# Altium project ControlBoard.PrjPcb
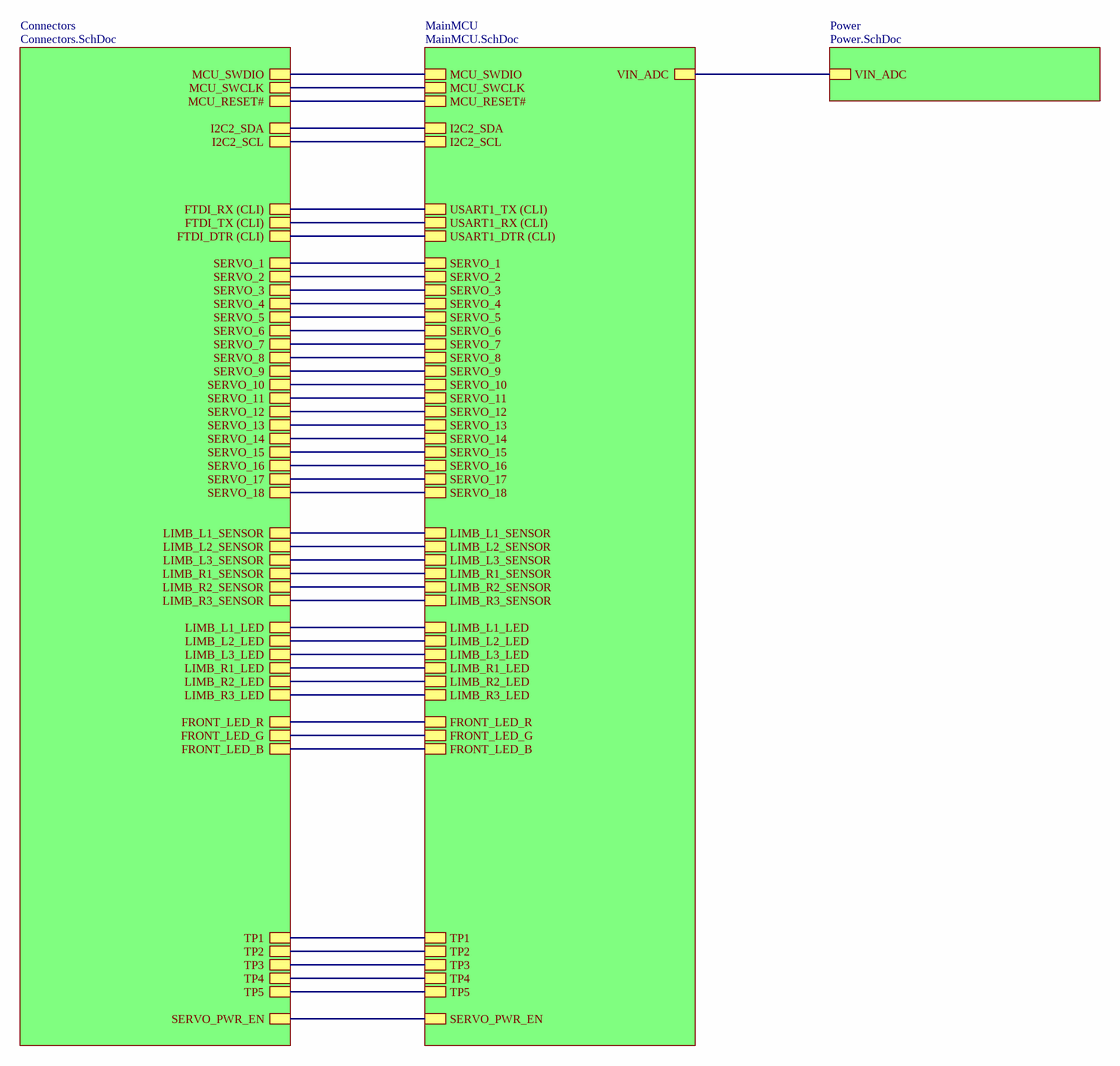
[diagram p0: Main.SchDoc]
4 sheets, 141 parts. Net scope: hierarchical (ports join the sheet entries above them; power ports are global).
Board file: PCB.PcbDoc
Sheets:
  Main.SchDoc
    Connectors = Connectors.SchDoc
    MainMCU = MainMCU.SchDoc
    Power = Power.SchDoc

## Sheet Main.SchDoc
size A3; SheetNumber: 1; SheetTotal: 1

### Sub-sheets
Connectors = Connectors.SchDoc: MCU_SWDIO, MCU_SWCLK, MCU_RESET#, FTDI_RX (CLI), FTDI_TX (CLI), SERVO_1, SERVO_2, SERVO_3, SERVO_4, SERVO_5, SERVO_6, SERVO_7, SERVO_8, SERVO_9, SERVO_10, SERVO_11, SERVO_12, SERVO_13, SERVO_14, SERVO_15, SERVO_16, SERVO_17, SERVO_18, SERVO_PWR_EN, I2C2_SDA, I2C2_SCL, FTDI_DTR (CLI), LIMB_L1_SENSOR, LIMB_L2_SENSOR, LIMB_L3_SENSOR, LIMB_R1_SENSOR, LIMB_R2_SENSOR, LIMB_R3_SENSOR, LIMB_L1_LED, LIMB_L2_LED, LIMB_L3_LED, LIMB_R1_LED, LIMB_R2_LED, LIMB_R3_LED, FRONT_LED_B, FRONT_LED_G, FRONT_LED_R, TP5, TP4, TP3, TP2, TP1
MainMCU = MainMCU.SchDoc: MCU_SWDIO, MCU_SWCLK, MCU_RESET#, USART1_TX (CLI), USART1_RX (CLI), VIN_ADC, SERVO_PWR_EN, I2C2_SDA, I2C2_SCL, USART1_DTR (CLI), SERVO_1, SERVO_2, SERVO_3, SERVO_4, SERVO_5, SERVO_6, SERVO_7, SERVO_8, SERVO_9, SERVO_10, SERVO_11, SERVO_12, SERVO_13, SERVO_14, SERVO_15, SERVO_16, SERVO_17, SERVO_18, LIMB_L1_SENSOR, LIMB_L2_SENSOR, LIMB_L3_SENSOR, LIMB_R1_SENSOR, LIMB_R2_SENSOR, LIMB_R3_SENSOR, FRONT_LED_R, FRONT_LED_G, FRONT_LED_B, TP5, TP4, TP3, TP2, TP1, LIMB_L1_LED, LIMB_L2_LED, LIMB_L3_LED, LIMB_R1_LED, LIMB_R2_LED, LIMB_R3_LED
Power = Power.SchDoc: VIN_ADC

### Nets
FRONT_LED_B: sheet Connectors/FRONT_LED_B, sheet MainMCU/FRONT_LED_B
FRONT_LED_G: sheet Connectors/FRONT_LED_G, sheet MainMCU/FRONT_LED_G
FRONT_LED_R: sheet Connectors/FRONT_LED_R, sheet MainMCU/FRONT_LED_R
FTDI_DTR (CLI): sheet Connectors/FTDI_DTR (CLI), sheet MainMCU/USART1_DTR (CLI)
FTDI_RX (CLI): sheet Connectors/FTDI_RX (CLI), sheet MainMCU/USART1_TX (CLI)
FTDI_TX (CLI): sheet Connectors/FTDI_TX (CLI), sheet MainMCU/USART1_RX (CLI)
I2C2_SCL: sheet Connectors/I2C2_SCL, sheet MainMCU/I2C2_SCL
I2C2_SDA: sheet Connectors/I2C2_SDA, sheet MainMCU/I2C2_SDA
LIMB_L1_LED: sheet Connectors/LIMB_L1_LED, sheet MainMCU/LIMB_L1_LED
LIMB_L1_SENSOR: sheet Connectors/LIMB_L1_SENSOR, sheet MainMCU/LIMB_L1_SENSOR
LIMB_L2_LED: sheet Connectors/LIMB_L2_LED, sheet MainMCU/LIMB_L2_LED
LIMB_L2_SENSOR: sheet Connectors/LIMB_L2_SENSOR, sheet MainMCU/LIMB_L2_SENSOR
LIMB_L3_LED: sheet Connectors/LIMB_L3_LED, sheet MainMCU/LIMB_L3_LED
LIMB_L3_SENSOR: sheet Connectors/LIMB_L3_SENSOR, sheet MainMCU/LIMB_L3_SENSOR
LIMB_R1_LED: sheet Connectors/LIMB_R1_LED, sheet MainMCU/LIMB_R1_LED
LIMB_R1_SENSOR: sheet Connectors/LIMB_R1_SENSOR, sheet MainMCU/LIMB_R1_SENSOR
LIMB_R2_LED: sheet Connectors/LIMB_R2_LED, sheet MainMCU/LIMB_R2_LED
LIMB_R2_SENSOR: sheet Connectors/LIMB_R2_SENSOR, sheet MainMCU/LIMB_R2_SENSOR
LIMB_R3_LED: sheet Connectors/LIMB_R3_LED, sheet MainMCU/LIMB_R3_LED
LIMB_R3_SENSOR: sheet Connectors/LIMB_R3_SENSOR, sheet MainMCU/LIMB_R3_SENSOR
MCU_RESET#: sheet Connectors/MCU_RESET#, sheet MainMCU/MCU_RESET#
MCU_SWCLK: sheet Connectors/MCU_SWCLK, sheet MainMCU/MCU_SWCLK
MCU_SWDIO: sheet Connectors/MCU_SWDIO, sheet MainMCU/MCU_SWDIO
SERVO_1: sheet Connectors/SERVO_1, sheet MainMCU/SERVO_1
SERVO_2: sheet Connectors/SERVO_2, sheet MainMCU/SERVO_2
SERVO_3: sheet Connectors/SERVO_3, sheet MainMCU/SERVO_3
SERVO_4: sheet Connectors/SERVO_4, sheet MainMCU/SERVO_4
SERVO_5: sheet Connectors/SERVO_5, sheet MainMCU/SERVO_5
SERVO_6: sheet Connectors/SERVO_6, sheet MainMCU/SERVO_6
SERVO_7: sheet Connectors/SERVO_7, sheet MainMCU/SERVO_7
SERVO_8: sheet Connectors/SERVO_8, sheet MainMCU/SERVO_8
SERVO_9: sheet Connectors/SERVO_9, sheet MainMCU/SERVO_9
SERVO_10: sheet Connectors/SERVO_10, sheet MainMCU/SERVO_10
SERVO_11: sheet Connectors/SERVO_11, sheet MainMCU/SERVO_11
SERVO_12: sheet Connectors/SERVO_12, sheet MainMCU/SERVO_12
SERVO_13: sheet Connectors/SERVO_13, sheet MainMCU/SERVO_13
SERVO_14: sheet Connectors/SERVO_14, sheet MainMCU/SERVO_14
SERVO_15: sheet Connectors/SERVO_15, sheet MainMCU/SERVO_15
SERVO_16: sheet Connectors/SERVO_16, sheet MainMCU/SERVO_16
SERVO_17: sheet Connectors/SERVO_17, sheet MainMCU/SERVO_17
SERVO_18: sheet Connectors/SERVO_18, sheet MainMCU/SERVO_18
SERVO_PWR_EN: sheet Connectors/SERVO_PWR_EN, sheet MainMCU/SERVO_PWR_EN
TP1: sheet Connectors/TP1, sheet MainMCU/TP1
TP2: sheet Connectors/TP2, sheet MainMCU/TP2
TP3: sheet Connectors/TP3, sheet MainMCU/TP3
TP4: sheet Connectors/TP4, sheet MainMCU/TP4
TP5: sheet Connectors/TP5, sheet MainMCU/TP5
VIN_ADC: sheet MainMCU/VIN_ADC, sheet Power/VIN_ADC

## Sheet Connectors.SchDoc
size A4; SheetNumber: 1; SheetTotal: 1
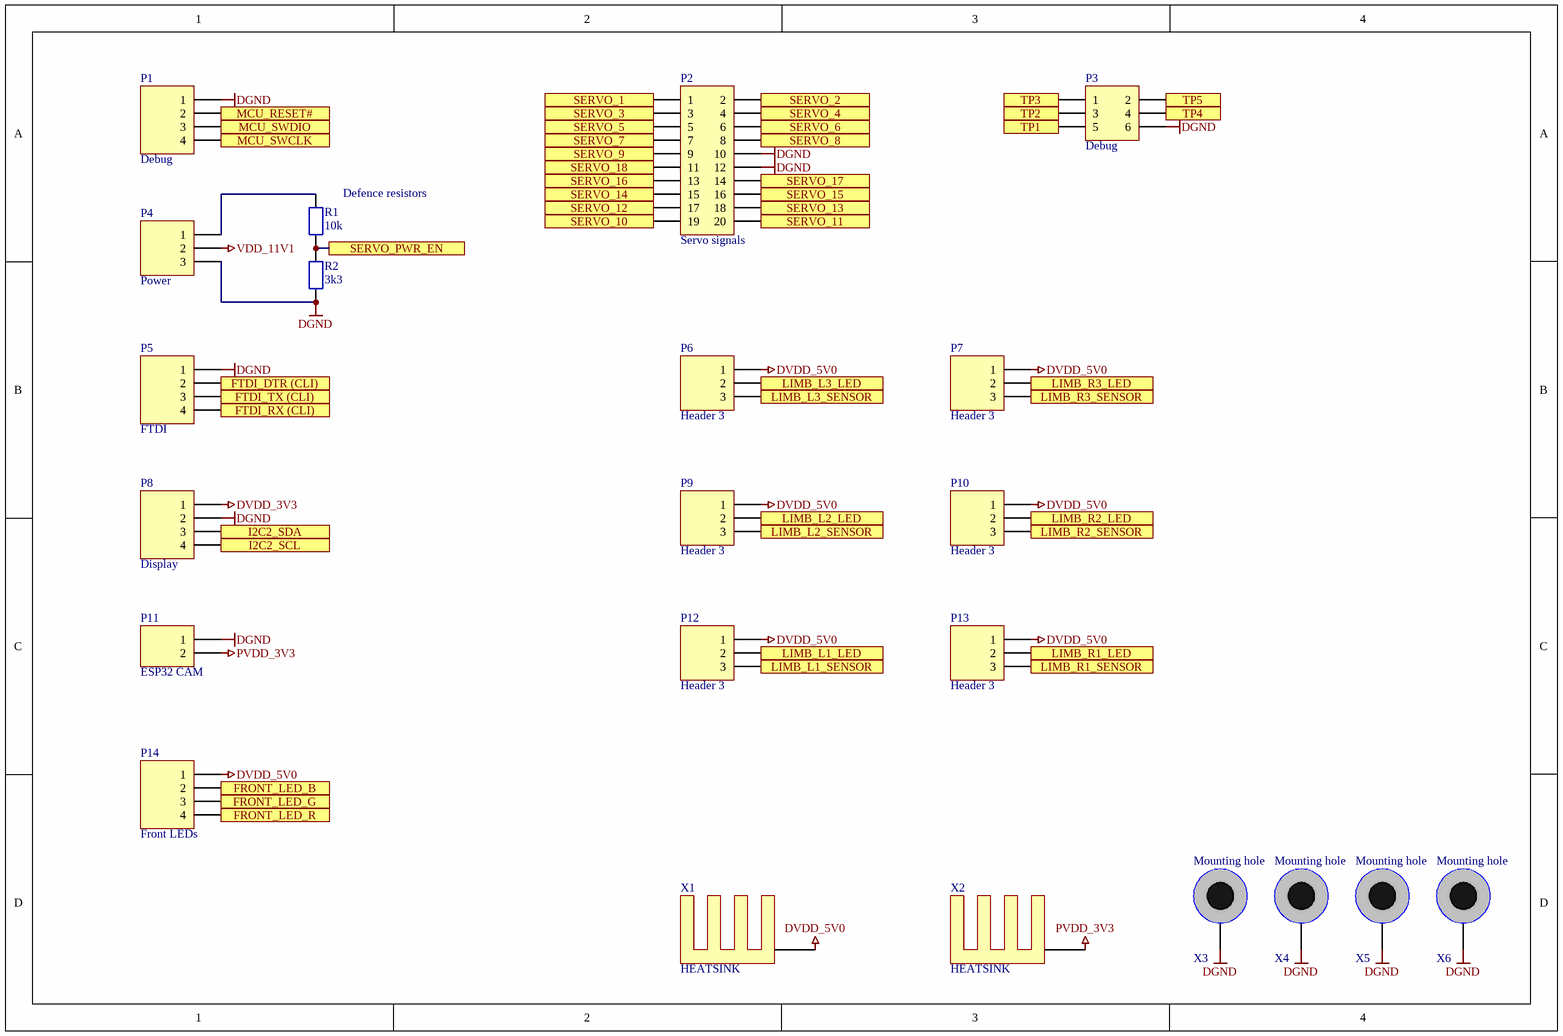
[diagram p1: Connectors.SchDoc]

### Parts
P1  Debug  [PLS-4 2.54]
P2  Servo signals  [IDC-20 OUTLINE]
P3  Debug  [PLD-3 2.54]
P4  Power  [PLS-3 2.54 OUTLINE]
P5  FTDI  [PLS-4R 2.54]
P6  Header 3  [PLS-3R 2.54]
P7  Header 3  [PLS-3R 2.54]
P8  Display  [PLS-4R 2.54]
P9  Header 3  [PLS-3R 2.54]
P10  Header 3  [PLS-3R 2.54]
P11  ESP32 CAM  [PLS-2 2.54 OUTLINE]
P12  Header 3  [PLS-3R 2.54]
P13  Header 3  [PLS-3R 2.54]
P14  Front LEDs  [PLS-4R 2.54]
R1  10k  [R_0603/1608]
R2  3k3  [R_0603/1608]
X1  HEATSINK  [HEATSINK 20x14x6]
X2  HEATSINK  [HEATSINK 20x14x6]
X3  Mounting hole  [HOLE_M2_D4.0/2.5]  (no BOM)
X4  Mounting hole  [HOLE_M2_D4.0/2.5]  (no BOM)
X5  Mounting hole  [HOLE_M2_D4.0/2.5]  (no BOM)
X6  Mounting hole  [HOLE_M2_D4.0/2.5]  (no BOM)

### Ports
FRONT_LED_B, FRONT_LED_G, FRONT_LED_R, FTDI_DTR (CLI), FTDI_RX (CLI), FTDI_TX (CLI), I2C2_SCL, I2C2_SDA, LIMB_L1_LED, LIMB_L1_SENSOR, LIMB_L2_LED, LIMB_L2_SENSOR, LIMB_L3_LED, LIMB_L3_SENSOR, LIMB_R1_LED, LIMB_R1_SENSOR, LIMB_R2_LED, LIMB_R2_SENSOR, LIMB_R3_LED, LIMB_R3_SENSOR, MCU_RESET#, MCU_SWCLK, MCU_SWDIO, SERVO_1, SERVO_2, SERVO_3, SERVO_4, SERVO_5, SERVO_6, SERVO_7, SERVO_8, SERVO_9, SERVO_10, SERVO_11, SERVO_12, SERVO_13, SERVO_14, SERVO_15, SERVO_16, SERVO_17, SERVO_18, SERVO_PWR_EN, TP1, TP2, TP3, TP4, TP5

### Nets
DGND: P1.1 P2.10 P2.12 P3.6 P4.3 P5.1 P8.2 P11.1 R2.1 X3.1 X4.1 X5.1 X6.1
DVDD_3V3: P8.1
DVDD_5V0: P6.1 P7.1 P9.1 P10.1 P12.1 P13.1 P14.1 X1.1
PVDD_3V3: P11.2 X2.1
VDD_11V1: P4.2
FRONT_LED_B: P14.2 ; port FRONT_LED_B
FRONT_LED_G: P14.3 ; port FRONT_LED_G
FRONT_LED_R: P14.4 ; port FRONT_LED_R
FTDI_DTR (CLI): P5.2 ; port FTDI_DTR (CLI)
FTDI_RX (CLI): P5.4 ; port FTDI_RX (CLI)
FTDI_TX (CLI): P5.3 ; port FTDI_TX (CLI)
I2C2_SCL: P8.4 ; port I2C2_SCL
I2C2_SDA: P8.3 ; port I2C2_SDA
LIMB_L1_LED: P12.2 ; port LIMB_L1_LED
LIMB_L1_SENSOR: P12.3 ; port LIMB_L1_SENSOR
LIMB_L2_LED: P9.2 ; port LIMB_L2_LED
LIMB_L2_SENSOR: P9.3 ; port LIMB_L2_SENSOR
LIMB_L3_LED: P6.2 ; port LIMB_L3_LED
LIMB_L3_SENSOR: P6.3 ; port LIMB_L3_SENSOR
LIMB_R1_LED: P13.2 ; port LIMB_R1_LED
LIMB_R1_SENSOR: P13.3 ; port LIMB_R1_SENSOR
LIMB_R2_LED: P10.2 ; port LIMB_R2_LED
LIMB_R2_SENSOR: P10.3 ; port LIMB_R2_SENSOR
LIMB_R3_LED: P7.2 ; port LIMB_R3_LED
LIMB_R3_SENSOR: P7.3 ; port LIMB_R3_SENSOR
MCU_RESET#: P1.2 ; port MCU_RESET#
MCU_SWCLK: P1.4 ; port MCU_SWCLK
MCU_SWDIO: P1.3 ; port MCU_SWDIO
SERVO_1: P2.1 ; port SERVO_1
SERVO_2: P2.2 ; port SERVO_2
SERVO_3: P2.3 ; port SERVO_3
SERVO_4: P2.4 ; port SERVO_4
SERVO_5: P2.5 ; port SERVO_5
SERVO_6: P2.6 ; port SERVO_6
SERVO_7: P2.7 ; port SERVO_7
SERVO_8: P2.8 ; port SERVO_8
SERVO_9: P2.9 ; port SERVO_9
SERVO_10: P2.19 ; port SERVO_10
SERVO_11: P2.20 ; port SERVO_11
SERVO_12: P2.17 ; port SERVO_12
SERVO_13: P2.18 ; port SERVO_13
SERVO_14: P2.15 ; port SERVO_14
SERVO_15: P2.16 ; port SERVO_15
SERVO_16: P2.13 ; port SERVO_16
SERVO_17: P2.14 ; port SERVO_17
SERVO_18: P2.11 ; port SERVO_18
SERVO_PWR_EN: R1.1 R2.2 ; port SERVO_PWR_EN
TP1: P3.5 ; port TP1
TP2: P3.3 ; port TP2
TP3: P3.1 ; port TP3
TP4: P3.4 ; port TP4
TP5: P3.2 ; port TP5
NetP4_1: P4.1 R1.2

### Notes on the sheet
- (near R1) Defence resistors

### Library data of the parts
P1 P5 P8 P14 = Header 4: Header, 4-Pin; LatestRevisionDate: 17-Jul-2002; LatestRevisionNote: Re-released for DXP Platform.; Publisher: Altium Limited
P2 = Header 2x10: Header, 20-Pin; LatestRevisionDate: 17-Jul-2002; LatestRevisionNote: Re-released for DXP Platform.; Publisher: Altium Limited
P3 = Header 2x3: Header, 2x3-Pin; LatestRevisionDate: 17-Jul-2002; LatestRevisionNote: Re-released for DXP Platform.; Publisher: Altium Limited
P4 P6 P7 P9 P10 P12 P13 = Header 3: Header, 3-Pin; LatestRevisionDate: 17-Jul-2002; LatestRevisionNote: Re-released for DXP Platform.; Publisher: Altium Limited
P11 = Header 2: Header, 2-Pin; LatestRevisionDate: 17-Jul-2002; LatestRevisionNote: Re-released for DXP Platform.; Publisher: Altium Limited
R1 R2 = Resistor
X3-X6 = Mounting hole: Hole for screw M3, outline D6

## Sheet MainMCU.SchDoc
size A3; SheetNumber: 1; SheetTotal: 1
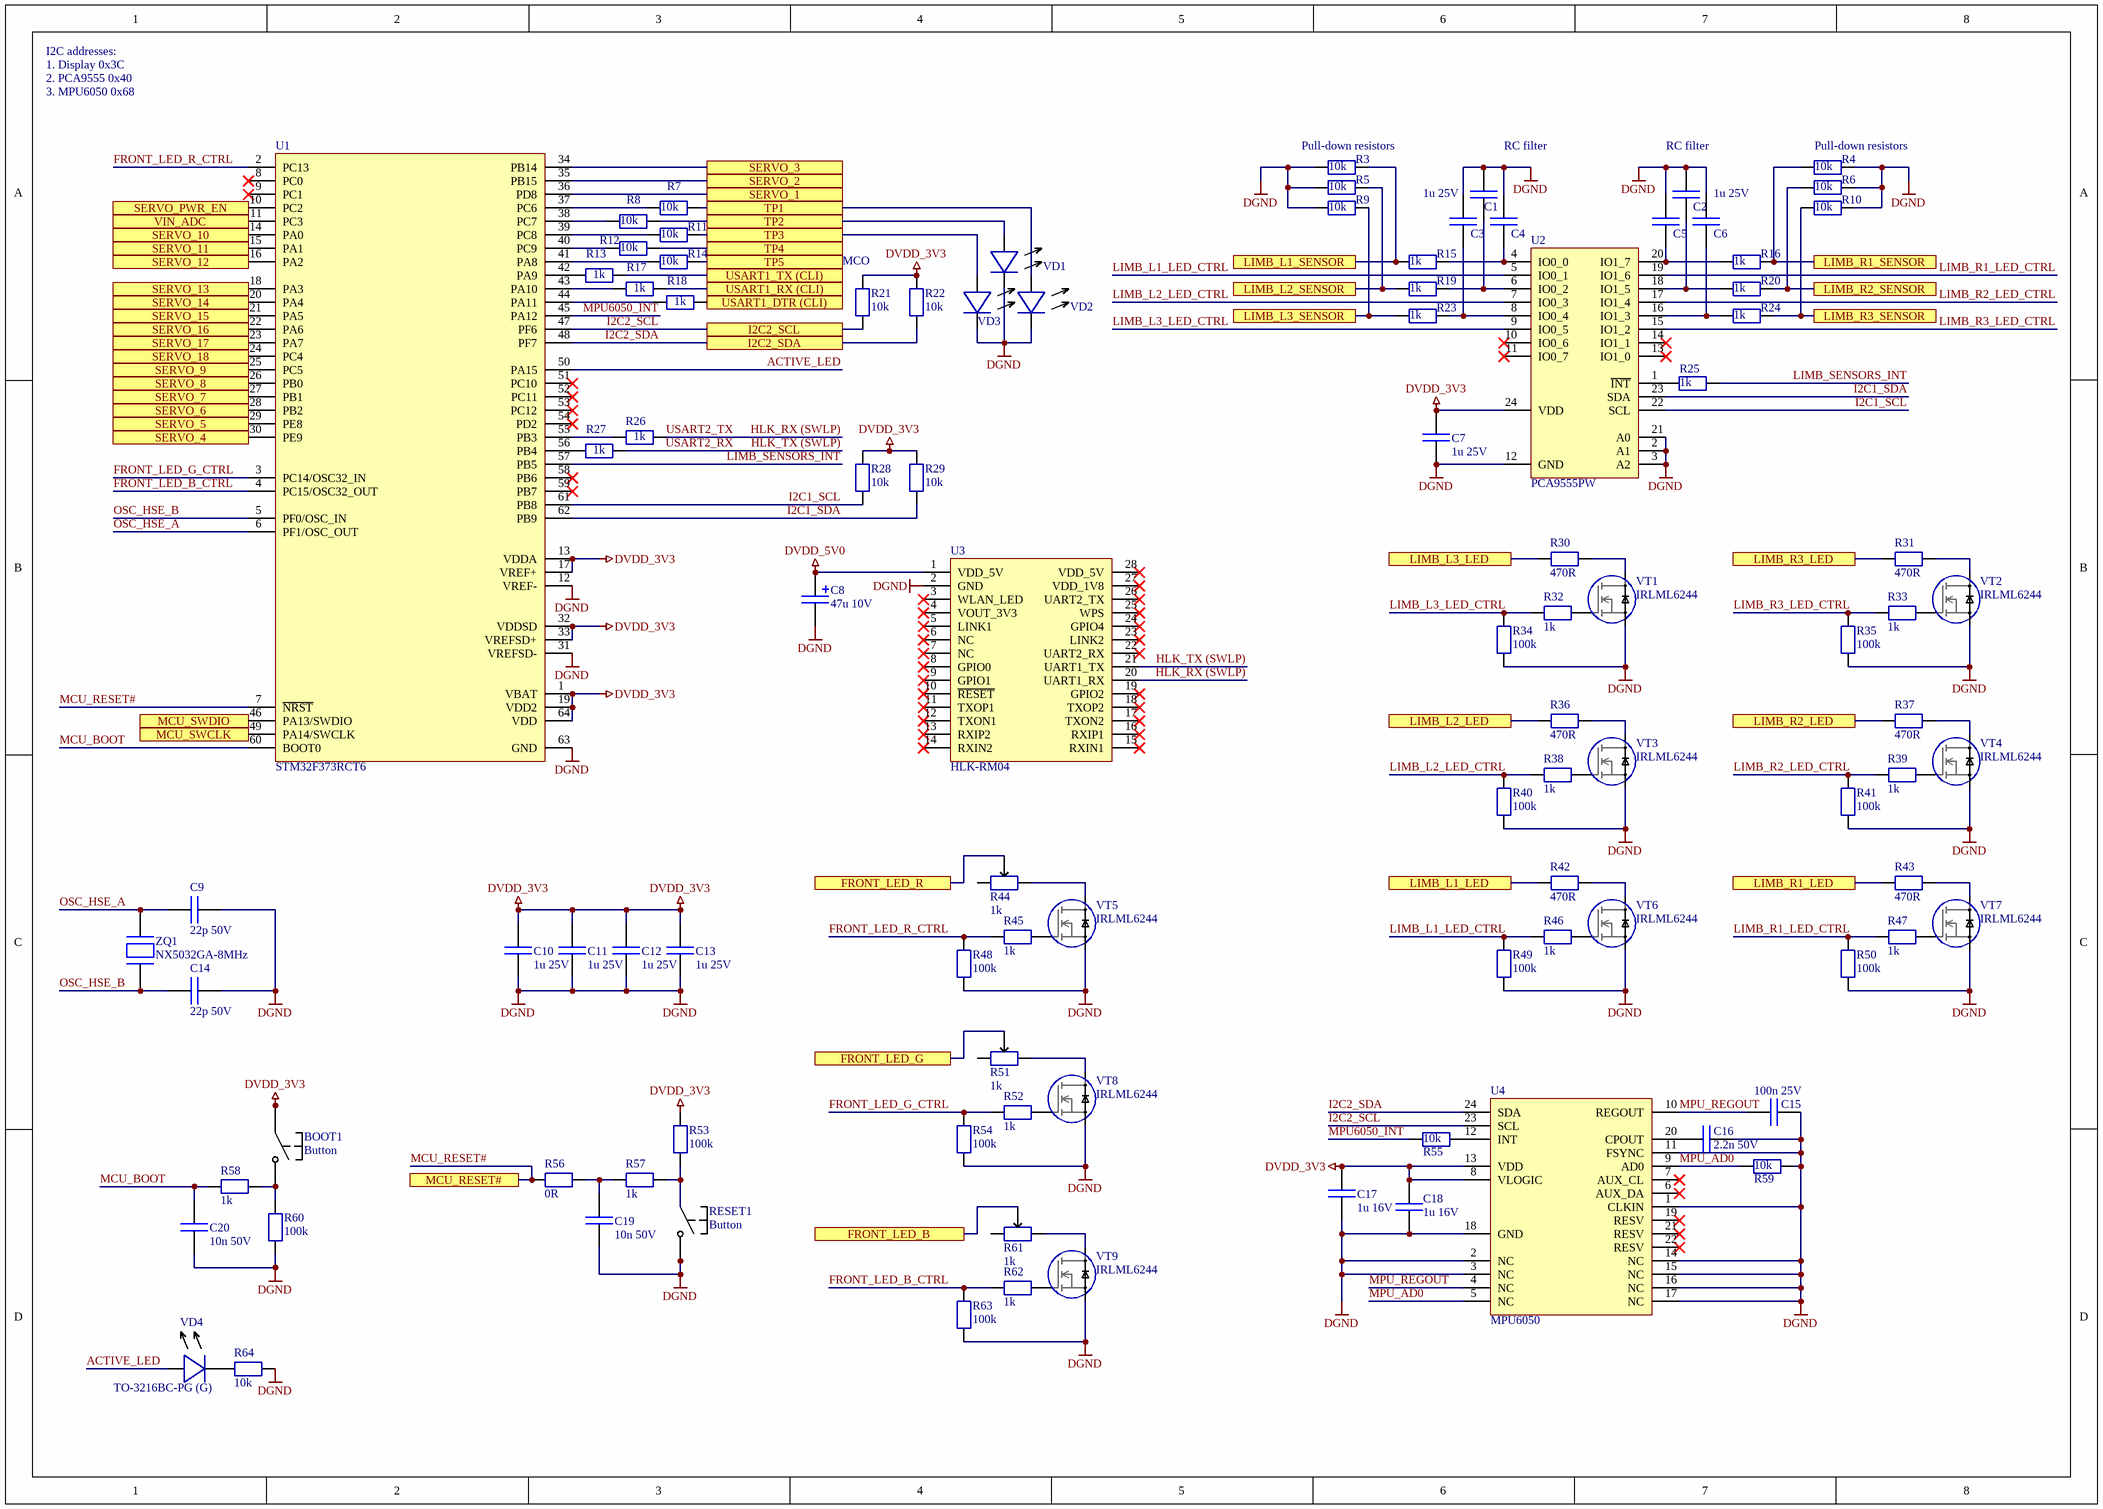
[diagram p2: MainMCU.SchDoc]

### Parts
BOOT1  Button  [BUTTON_SMD_3x6]
C1  1u 25V  [C_0603/1608]
C2  1u 25V  [C_0603/1608]
C3  1u 25V  [C_0603/1608]  (value not drawn)
C4  1u 25V  [C_0603/1608]  (value not drawn)
C5  1u 25V  [C_0603/1608]  (value not drawn)
C6  1u 25V  [C_0603/1608]  (value not drawn)
C7  1u 25V  [C_0603/1608]
C8  47u 10V  [TECAP_TYPE_B]
C9  22p 50V  [C_0603/1608]
C10  1u 25V  [C_0603/1608]
C11  1u 25V  [C_0603/1608]
C12  1u 25V  [C_0603/1608]
C13  1u 25V  [C_0603/1608]
C14  22p 50V  [C_0603/1608]
C15  100n 25V  [C_0603/1608]
C16  2.2n 50V  [C_0603/1608]
C17  1u 16V  [C_0402/1005]
C18  1u 16V  [C_0402/1005]
C19  10n 50V  [C_0603/1608]
C20  10n 50V  [C_0603/1608]
R3  10k  [R_0603/1608]
R4  10k  [R_0603/1608]
R5  10k  [R_0603/1608]
R6  10k  [R_0603/1608]
R7  10k  [R_0603/1608]
R8  10k  [R_0603/1608]
R9  10k  [R_0603/1608]
R10  10k  [R_0603/1608]
R11  10k  [R_0603/1608]
R12  10k  [R_0603/1608]
R13  1k  [R_0603/1608]
R14  10k  [R_0603/1608]
R15  1k  [R_0603/1608]
R16  1k  [R_0603/1608]
R17  1k  [R_0603/1608]
R18  1k  [R_0603/1608]
R19  1k  [R_0603/1608]
R20  1k  [R_0603/1608]
R21  10k  [R_0603/1608]
R22  10k  [R_0603/1608]
R23  1k  [R_0603/1608]
R24  1k  [R_0603/1608]
R25  1k  [R_0603/1608]
R26  1k  [R_0603/1608]
R27  1k  [R_0603/1608]
R28  10k  [R_0603/1608]
R29  10k  [R_0603/1608]
R30  470R  [R_0603/1608]
R31  470R  [R_0603/1608]
R32  1k  [R_0603/1608]
R33  1k  [R_0603/1608]
R34  100k  [R_0603/1608]
R35  100k  [R_0603/1608]
R36  470R  [R_0603/1608]
R37  470R  [R_0603/1608]
R38  1k  [R_0603/1608]
R39  1k  [R_0603/1608]
R40  100k  [R_0603/1608]
R41  100k  [R_0603/1608]
R42  470R  [R_0603/1608]
R43  470R  [R_0603/1608]
R44  1k  [R_VAR_3.2x3.2_SMD]
R45  1k  [R_0603/1608]
R46  1k  [R_0603/1608]
R47  1k  [R_0603/1608]
R48  100k  [R_0603/1608]
R49  100k  [R_0603/1608]
R50  100k  [R_0603/1608]
R51  1k  [R_VAR_3.2x3.2_SMD]
R52  1k  [R_0603/1608]
R53  100k  [R_0603/1608]
R54  100k  [R_0603/1608]
R55  10k  [R_0603/1608]
R56  0R  [R_0603/1608]
R57  1k  [R_0603/1608]
R58  1k  [R_0603/1608]
R59  10k  [R_0603/1608]
R60  100k  [R_0603/1608]
R61  1k  [R_VAR_3.2x3.2_SMD]
R62  1k  [R_0603/1608]
R63  100k  [R_0603/1608]
R64  10k  [R_0603/1608]
RESET1  Button  [BUTTON_SMD_3x6]
U1  STM32F373RCT6  [LQFP64]
U2  PCA9555PW  [SO24_0.65]
U3  HLK-RM04  [HLK-RM04]
U4  MPU6050  [MPU6050]
VD1  TO-3216BC-PG (G)  [LED_0603/1608]  (value not drawn)
VD2  TO-3216BC-PG (G)  [LED_0603/1608]  (value not drawn)
VD3  TO-3216BC-PG (G)  [LED_0603/1608]  (value not drawn)
VD4  TO-3216BC-PG (G)  [LED_0603/1608]
VT1  IRLML6244  [SOT23-3]
VT2  IRLML6244  [SOT23-3]
VT3  IRLML6244  [SOT23-3]
VT4  IRLML6244  [SOT23-3]
VT5  IRLML6244  [SOT23-3]
VT6  IRLML6244  [SOT23-3]
VT7  IRLML6244  [SOT23-3]
VT8  IRLML6244  [SOT23-3]
VT9  IRLML6244  [SOT23-3]
ZQ1  NX5032GA-8MHz  [OSC_2PINS SMD]

### Ports
FRONT_LED_B, FRONT_LED_G, FRONT_LED_R, I2C2_SCL, I2C2_SDA, LIMB_L1_LED, LIMB_L1_SENSOR, LIMB_L2_LED, LIMB_L2_SENSOR, LIMB_L3_LED, LIMB_L3_SENSOR, LIMB_R1_LED, LIMB_R1_SENSOR, LIMB_R2_LED, LIMB_R2_SENSOR, LIMB_R3_LED, LIMB_R3_SENSOR, MCU_RESET#, MCU_SWCLK, MCU_SWDIO, SERVO_1, SERVO_2, SERVO_3, SERVO_4, SERVO_5, SERVO_6, SERVO_7, SERVO_8, SERVO_9, SERVO_10, SERVO_11, SERVO_12, SERVO_13, SERVO_14, SERVO_15, SERVO_16, SERVO_17, SERVO_18, SERVO_PWR_EN, TP1, TP2, TP3, TP4, TP5, USART1_DTR (CLI), USART1_RX (CLI), USART1_TX (CLI), VIN_ADC

### Nets
DGND: C1.1 C2.1 C3.1 C4.1 C5.1 C6.1 C7.2 C8.2(NEG) C9.2 C10.2 C11.2 C12.2 C13.2 C14.2 C15.2 C16.2 C17.2 C18.2 C19.2 C20.2 R3.1 R4.1 R5.1 R6.1 R9.1 R10.1 R34.1 R35.1 R40.1 R41.1 R48.1 R49.1 R50.1 R54.1 R59.1 R60.2 R63.1 R64.1 RESET1.2 RESET1.4 U1.12(VREF-) U1.31(VREFSD-) U1.63(GND) U2.2(A1) U2.3(A2) U2.12(GND) U2.21(A0) U3.2(GND) U4.1(CLKIN) U4.2(NC) U4.3(NC) U4.11(FSYNC) U4.14(NC) U4.15(NC) U4.16(NC) U4.17(NC) U4.18(GND) VD1.C VD2.C VD3.C VT1.S VT2.S VT3.S VT4.S VT5.S VT6.S VT7.S VT8.S VT9.S
DVDD_3V3: BOOT1.1 BOOT1.3 C7.1 C10.1 C11.1 C12.1 C13.1 C17.1 C18.1 R21.2 R22.2 R28.2 R29.2 R53.1 U1.1(VBAT) U1.13(VDDA) U1.17(VREF+) U1.19(VDD2) U1.32(VDDSD) U1.33(VREFSD+) U1.64(VDD) U2.24(VDD) U4.8(VLOGIC) U4.13(VDD)
DVDD_5V0: C8.1(POS) U3.1(VDD_5V)
ACTIVE_LED: U1.50(PA15) VD4.A
FRONT_LED_B: R61.2 ; port FRONT_LED_B
FRONT_LED_B_CTRL: R62.2 R63.2 U1.4(PC15/OSC32_OUT)
FRONT_LED_G: R51.2 ; port FRONT_LED_G
FRONT_LED_G_CTRL: R52.2 R54.2 U1.3(PC14/OSC32_IN)
FRONT_LED_R: R44.2 ; port FRONT_LED_R
FRONT_LED_R_CTRL: R45.2 R48.2 U1.2(PC13)
FTDI_DTR (CLI): R18.1 ; port USART1_DTR (CLI)
FTDI_RX (CLI): R13.1 ; port USART1_TX (CLI)
FTDI_TX (CLI): R17.1 ; port USART1_RX (CLI)
HLK_RX (SWLP): R26.1 U3.20(UART1_RX)  [also labelled USART2_TX]
HLK_TX (SWLP): R27.1 U3.21(UART1_TX)  [also labelled USART2_RX]
I2C1_SCL: R28.1 U1.61(PB8) U2.22(SCL)
I2C1_SDA: R29.1 U1.62(PB9) U2.23(SDA)
I2C2_SCL: R21.1 U1.47(PF6) U4.23(SCL) ; port I2C2_SCL
I2C2_SDA: R22.1 U1.48(PF7) U4.24(SDA) ; port I2C2_SDA
LIMB_L1_LED: R42.2 ; port LIMB_L1_LED
LIMB_L1_LED_CTRL: R46.2 R49.2 U2.5(IO0_1)
LIMB_L1_SENSOR: R3.2 R15.1 ; port LIMB_L1_SENSOR
LIMB_L2_LED: R36.2 ; port LIMB_L2_LED
LIMB_L2_LED_CTRL: R38.2 R40.2 U2.7(IO0_3)
LIMB_L2_SENSOR: R5.2 R19.1 ; port LIMB_L2_SENSOR
LIMB_L3_LED: R30.2 ; port LIMB_L3_LED
LIMB_L3_LED_CTRL: R32.2 R34.2 U2.9(IO0_5)
LIMB_L3_SENSOR: R9.2 R23.1 ; port LIMB_L3_SENSOR
LIMB_R1_LED: R43.2 ; port LIMB_R1_LED
LIMB_R1_LED_CTRL: R47.2 R50.2 U2.19(IO1_6)
LIMB_R1_SENSOR: R4.2 R16.2 ; port LIMB_R1_SENSOR
LIMB_R2_LED: R37.2 ; port LIMB_R2_LED
LIMB_R2_LED_CTRL: R39.2 R41.2 U2.17(IO1_4)
LIMB_R2_SENSOR: R6.2 R20.2 ; port LIMB_R2_SENSOR
LIMB_R3_LED: R31.2 ; port LIMB_R3_LED
LIMB_R3_LED_CTRL: R33.2 R35.2 U2.15(IO1_2)
LIMB_R3_SENSOR: R10.2 R24.2 ; port LIMB_R3_SENSOR
LIMB_SENSORS_INT: R25.2 U1.57(PB5)
MCU_BOOT: C20.1 R58.2 U1.60(BOOT0)
MCU_RESET#: R56.2 U1.7(~{NRST}) ; port MCU_RESET#
MCU_SWCLK: U1.49(PA14/SWCLK) ; port MCU_SWCLK
MCU_SWDIO: U1.46(PA13/SWDIO) ; port MCU_SWDIO
MPU6050_INT: R55.2 U1.45(PA12)
MPU_AD0: R59.2 U4.5(NC) U4.9(AD0)
MPU_REGOUT: C15.1 U4.4(NC) U4.10(REGOUT)
OSC_HSE_A: C9.1 U1.6(PF1/OSC_OUT) ZQ1.2
OSC_HSE_B: C14.1 U1.5(PF0/OSC_IN) ZQ1.1
SERVO_1: U1.36(PD8) ; port SERVO_1
SERVO_2: U1.35(PB15) ; port SERVO_2
SERVO_3: U1.34(PB14) ; port SERVO_3
SERVO_4: U1.30(PE9) ; port SERVO_4
SERVO_5: U1.29(PE8) ; port SERVO_5
SERVO_6: U1.28(PB2) ; port SERVO_6
SERVO_7: U1.27(PB1) ; port SERVO_7
SERVO_8: U1.26(PB0) ; port SERVO_8
SERVO_9: U1.25(PC5) ; port SERVO_9
SERVO_10: U1.14(PA0) ; port SERVO_10
SERVO_11: U1.15(PA1) ; port SERVO_11
SERVO_12: U1.16(PA2) ; port SERVO_12
SERVO_13: U1.18(PA3) ; port SERVO_13
SERVO_14: U1.20(PA4) ; port SERVO_14
SERVO_15: U1.21(PA5) ; port SERVO_15
SERVO_16: U1.22(PA6) ; port SERVO_16
SERVO_17: U1.23(PA7) ; port SERVO_17
SERVO_18: U1.24(PC4) ; port SERVO_18
SERVO_PWR_EN: U1.10(PC2) ; port SERVO_PWR_EN
TP1: R7.2 VD2.A ; port TP1
TP2: R8.2 VD1.A ; port TP2
TP3: R11.2 VD3.A ; port TP3
TP4: R12.2 ; port TP4
TP5: R14.2 ; port TP5
VIN_ADC: U1.11(PC3) ; port VIN_ADC
NetBOOT1_2: BOOT1.2 BOOT1.4 R58.1 R60.1
NetC1_2: C1.2 R19.2 U2.6(IO0_2)
NetC2_2: C2.2 R20.1 U2.18(IO1_5)
NetC3_2: C3.2 R23.2 U2.8(IO0_4)
NetC4_2: C4.2 R15.2 U2.4(IO0_0)
NetC5_2: C5.2 R16.1 U2.20(IO1_7)
NetC6_2: C6.2 R24.1 U2.16(IO1_3)
NetC16_1: C16.1 U4.20(CPOUT)
NetC19_1: C19.1 R56.1 R57.2
NetR7_1: R7.1 U1.37(PC6)
NetR8_1: R8.1 U1.38(PC7)
NetR11_1: R11.1 U1.39(PC8)
NetR12_1: R12.1 U1.40(PC9)
NetR13_2: R13.2 U1.42(PA9)
NetR14_1: R14.1 U1.41(PA8)
NetR17_2: R17.2 U1.43(PA10)
NetR18_2: R18.2 U1.44(PA11)
NetR25_1: R25.1 U2.1(~{INT})
NetR26_2: R26.2 U1.55(PB3)
NetR27_2: R27.2 U1.56(PB4)
NetR30_1: R30.1 VT1.D
NetR31_1: R31.1 VT2.D
NetR32_1: R32.1 VT1.G
NetR33_1: R33.1 VT2.G
NetR36_1: R36.1 VT3.D
NetR37_1: R37.1 VT4.D
NetR38_1: R38.1 VT3.G
NetR39_1: R39.1 VT4.G
NetR42_1: R42.1 VT6.D
NetR43_1: R43.1 VT7.D
NetR44_3: R44.3 VT5.D
NetR45_1: R45.1 VT5.G
NetR46_1: R46.1 VT6.G
NetR47_1: R47.1 VT7.G
NetR51_3: R51.3 VT8.D
NetR52_1: R52.1 VT8.G
NetR53_2: R53.2 R57.1 RESET1.1 RESET1.3
NetR55_1: R55.1 U4.12(INT)
NetR61_3: R61.3 VT9.D
NetR62_1: R62.1 VT9.G
NetR64_2: R64.2 VD4.C

Not connected (* = marked no-connect by the designer): R44 1; R51 1; R61 1; U1 0(EP) 8(PC0)* 9(PC1)* 51(PC10)* 52(PC11)* 53(PC12)* 54(PD2)* 58(PB6)* 59(PB7)*; U2 10(IO0_6)* 11(IO0_7)* 13(IO1_0)* 14(IO1_1)*; U3 0(EP) 3(WLAN_LED)* 4(VOUT_3V3)* 5(LINK1)* 6(NC)* 7(NC)* 8(GPIO0)* 9(GPIO1)* 10(~{RESET})* 11(TXOP1)* 12(TXON1)* 13(RXIP2)* 14(RXIN2)* 15(RXIN1)* 16(RXIP1)* 17(TXON2)* 18(TXOP2)* 19(GPIO2)* 22(UART2_RX)* 23(LINK2)* 24(GPIO4)* 25(WPS)* 26(UART2_TX)* 27(VDD_1V8)* 28(VDD_5V)*; U4 0(EP) 6(AUX_DA)* 7(AUX_CL)* 19(RESV)* 21(RESV)* 22(RESV)*

### Notes on the sheet
- I2C addresses:
- 1. Display 0x3C
- 2. PCA9555 0x40
- 3. MPU6050 0x68
- (near R3) Pull-down resistors
- (near C1) RC filter
- (near C2) RC filter
- (near R4) Pull-down resistors
- (near R21) MCO

### Library data of the parts
BOOT1 RESET1 = Button: pin to pad: 3>1 4>2
C1-C7 C9-C20 = Capacitor: Non-polarized capacitor
C8 = Capacitor polar: Polarized capacitor
R3-R43 R45-R50 R52-R60 R62-R64 = Resistor
R44 R51 R61 = Resistor variable
U1 = STM32F373R: 32-bit Cortex-M3
U2 = PCA9555PW: 16 bits of General Purpose parallel / Input/Output (GPIO) expansion using I2C
U3 = HLK-RM04: WIFI-UART bridge
VD1-VD4 = LED
VT1-VT9 = MOSFET N: pin to pad: D>3 G>1 S>2
ZQ1 = Crystal oscillator

## Sheet Power.SchDoc
size A4; SheetNumber: 1; SheetTotal: 1
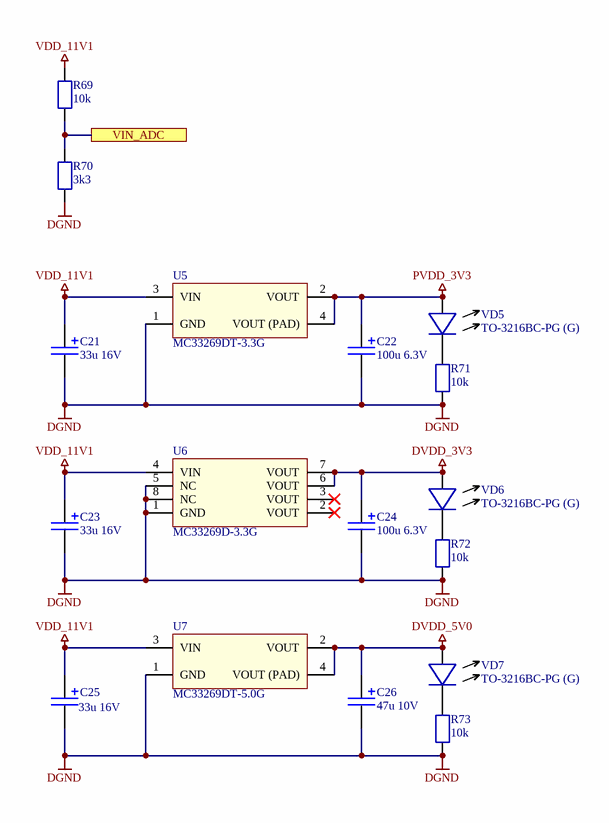
[diagram p3: Power.SchDoc]

### Parts
C21  33u 16V  [TECAP_TYPE_B]
C22  100u 6.3V  [TECAP_TYPE_B]
C23  33u 16V  [TECAP_TYPE_B]
C24  100u 6.3V  [TECAP_TYPE_B]
C25  33u 16V  [TECAP_TYPE_B]
C26  47u 10V  [TECAP_TYPE_B]
R69  10k  [R_0603/1608]
R70  3k3  [R_0603/1608]
R71  10k  [R_0603/1608]
R72  10k  [R_0603/1608]
R73  10k  [R_0603/1608]
U5  MC33269DT-3.3G  [TO252AA/DPAK]
U6  MC33269D-3.3G  [SO8_1.27]
U7  MC33269DT-5.0G  [TO252AA/DPAK]
VD5  TO-3216BC-PG (G)  [LED_0603/1608]
VD6  TO-3216BC-PG (G)  [LED_0603/1608]
VD7  TO-3216BC-PG (G)  [LED_0603/1608]

### Ports
VIN_ADC

### Nets
DGND: C21.2(NEG) C22.2(NEG) C23.2(NEG) C24.2(NEG) C25.2(NEG) C26.2(NEG) R70.1 R71.1 R72.1 R73.1 U5.1(GND) U6.1(GND) U6.5(NC) U6.8(NC) U7.1(GND)
DVDD_3V3: C24.1(POS) U6.6(VOUT) U6.7(VOUT) VD6.A
DVDD_5V0: C26.1(POS) U7.2(VOUT) U7.4(VOUT_(PAD)) VD7.A
PVDD_3V3: C22.1(POS) U5.2(VOUT) U5.4(VOUT_(PAD)) VD5.A
VDD_11V1: C21.1(POS) C23.1(POS) C25.1(POS) R69.2 U5.3(VIN) U6.4(VIN) U7.3(VIN)
VIN_ADC: R69.1 R70.2 ; port VIN_ADC
NetR71_2: R71.2 VD5.C
NetR72_2: R72.2 VD6.C
NetR73_2: R73.2 VD7.C

Not connected (* = marked no-connect by the designer): U6 2(VOUT)* 3(VOUT)*

### Library data of the parts
C21-C26 = Capacitor polar: Polarized capacitor
R69-R73 = Resistor
U5 U7 = MC33269DT: LDO voltage regulator; pin to pad: 2>3 3>2 4>3
U6 = MC33269D: LDO voltage regulator
VD5-VD7 = LED

## Nets that join several sheets
DGND: Connectors (13 pins), MainMCU (69 pins), Power (15 pins)
DVDD_3V3: Connectors (P8.1), MainMCU (24 pins), Power (C24.1 U6.6 U6.7 VD6.A)
DVDD_5V0: Connectors (8 pins), MainMCU (C8.1 U3.1), Power (C26.1 U7.2 U7.4 VD7.A)
PVDD_3V3: Connectors (P11.2 X2.1), Power (C22.1 U5.2 U5.4 VD5.A)
VDD_11V1: Connectors (P4.2), Power (7 pins)
FRONT_LED_B: Connectors (P14.2), MainMCU (R61.2)
FRONT_LED_G: Connectors (P14.3), MainMCU (R51.2)
FRONT_LED_R: Connectors (P14.4), MainMCU (R44.2)
FTDI_DTR (CLI): Connectors (P5.2), MainMCU (R18.1)
FTDI_RX (CLI): Connectors (P5.4), MainMCU (R13.1)
FTDI_TX (CLI): Connectors (P5.3), MainMCU (R17.1)
I2C2_SCL: Connectors (P8.4), MainMCU (R21.1 U1.47 U4.23)
I2C2_SDA: Connectors (P8.3), MainMCU (R22.1 U1.48 U4.24)
LIMB_L1_LED: Connectors (P12.2), MainMCU (R42.2)
LIMB_L1_SENSOR: Connectors (P12.3), MainMCU (R3.2 R15.1)
LIMB_L2_LED: Connectors (P9.2), MainMCU (R36.2)
LIMB_L2_SENSOR: Connectors (P9.3), MainMCU (R5.2 R19.1)
LIMB_L3_LED: Connectors (P6.2), MainMCU (R30.2)
LIMB_L3_SENSOR: Connectors (P6.3), MainMCU (R9.2 R23.1)
LIMB_R1_LED: Connectors (P13.2), MainMCU (R43.2)
LIMB_R1_SENSOR: Connectors (P13.3), MainMCU (R4.2 R16.2)
LIMB_R2_LED: Connectors (P10.2), MainMCU (R37.2)
LIMB_R2_SENSOR: Connectors (P10.3), MainMCU (R6.2 R20.2)
LIMB_R3_LED: Connectors (P7.2), MainMCU (R31.2)
LIMB_R3_SENSOR: Connectors (P7.3), MainMCU (R10.2 R24.2)
MCU_RESET#: Connectors (P1.2), MainMCU (R56.2 U1.7)
MCU_SWCLK: Connectors (P1.4), MainMCU (U1.49)
MCU_SWDIO: Connectors (P1.3), MainMCU (U1.46)
SERVO_1: Connectors (P2.1), MainMCU (U1.36)
SERVO_2: Connectors (P2.2), MainMCU (U1.35)
SERVO_3: Connectors (P2.3), MainMCU (U1.34)
SERVO_4: Connectors (P2.4), MainMCU (U1.30)
SERVO_5: Connectors (P2.5), MainMCU (U1.29)
SERVO_6: Connectors (P2.6), MainMCU (U1.28)
SERVO_7: Connectors (P2.7), MainMCU (U1.27)
SERVO_8: Connectors (P2.8), MainMCU (U1.26)
SERVO_9: Connectors (P2.9), MainMCU (U1.25)
SERVO_10: Connectors (P2.19), MainMCU (U1.14)
SERVO_11: Connectors (P2.20), MainMCU (U1.15)
SERVO_12: Connectors (P2.17), MainMCU (U1.16)
SERVO_13: Connectors (P2.18), MainMCU (U1.18)
SERVO_14: Connectors (P2.15), MainMCU (U1.20)
SERVO_15: Connectors (P2.16), MainMCU (U1.21)
SERVO_16: Connectors (P2.13), MainMCU (U1.22)
SERVO_17: Connectors (P2.14), MainMCU (U1.23)
SERVO_18: Connectors (P2.11), MainMCU (U1.24)
SERVO_PWR_EN: Connectors (R1.1 R2.2), MainMCU (U1.10)
TP1: Connectors (P3.5), MainMCU (R7.2 VD2.A)
TP2: Connectors (P3.3), MainMCU (R8.2 VD1.A)
TP3: Connectors (P3.1), MainMCU (R11.2 VD3.A)
TP4: Connectors (P3.4), MainMCU (R12.2)
TP5: Connectors (P3.2), MainMCU (R14.2)
VIN_ADC: MainMCU (U1.11), Power (R69.1 R70.2)

## Assembly variants
Base: all parts fitted